# EAGLE design MUSB-K552_Breakout (EAGLE 9.6.2)
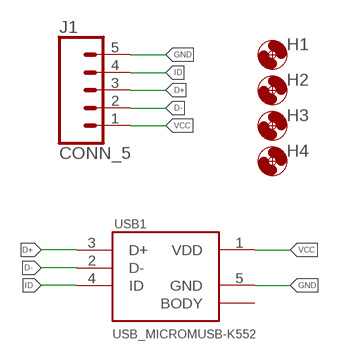
[diagram p0: schematic, sheet 1]

## Parts
H1  MOUNTING_HOLE2_NP  [2_56]
H2  MOUNTING_HOLE2_NP  [2_56]
H3  MOUNTING_HOLE2_NP  [2_56]
H4  MOUNTING_HOLE2_NP  [2_56]
J1  CONN_5  [1X05]
USB1  USB_MICROMUSB-K552  [MUSB-K552-30]

## Nets
D+: J1.3 USB1.3(D+)
D-: J1.2 USB1.2(D-)
GND: J1.5 USB1.5(GND)
ID: J1.4 USB1.4(ID)
VCC: J1.1 USB1.1(VDD)
Unconnected: USB1.P$1(BODY) USB1.P$2(BODY) USB1.P$3(BODY) USB1.P$4(BODY)

## Library data of the parts
H1-H4 = bschulz:MOUNTING_HOLE: Genaric Mechanical Mounting Hole Hole diameter based on max body diameter + 15% Keepout ring is for diameter of socket cap screw (minimum required clearance) TPlace ring is for diameter of pan head screw (recomended clearance) Specifications: Socket Cap <http://fastener-express.com/fastener-technical/SocketscapSS-Alloy.pdf> Button Head Socket Cap <http://fastener-express.com/fastener-technical/Button-Socket-alloy.pdf> Pan Head <http://fastener-express.com/fastener-technical/pan-machine-Screws.pdf>; DIGIKEY: DNP; MF: N/A; MPN: DNP
J1 = bschulz:CONN_5: Genaric 5 terminal header
USB1 = bschulz:USB_MICRO: General Micro USB - AB Connector; DIGIKEY: MUSB-K552-30-ND; MF: Amphenol; MPN: MUSB-K552-30

## Board
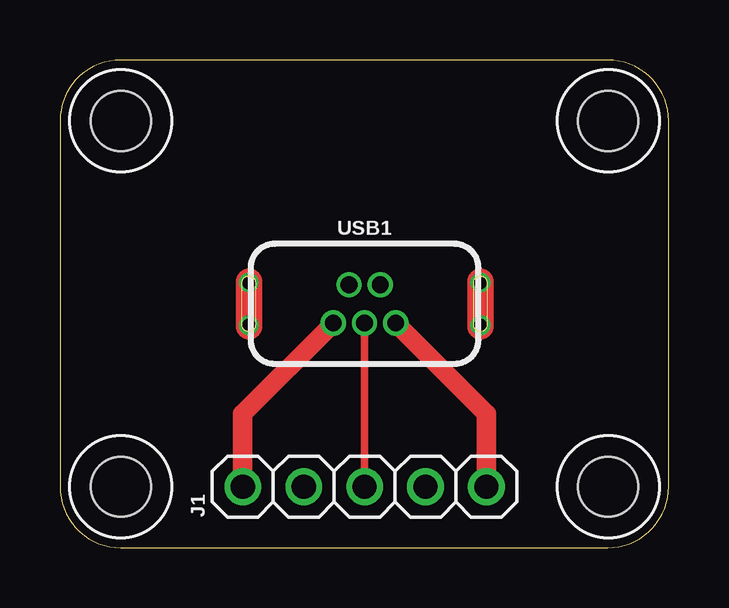
[diagram p1: board, top side]
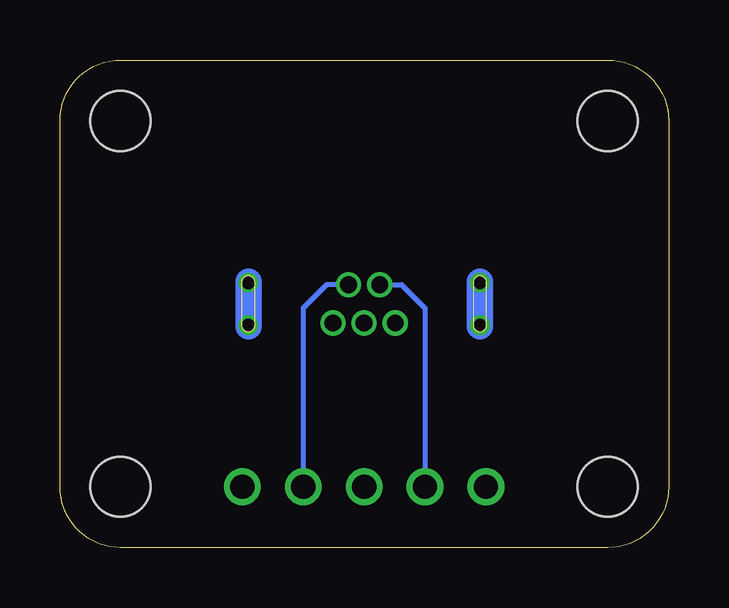
[diagram p2: board, bottom side, seen from below]

Size 25.38 x 20.32 mm. Coordinates in mm from the lower left corner, seen from the top.
Outline: 0,17.78 0,2.54 arc90 2.54,0 22.84,0 arc90 25.38,2.54 25.38,17.78 arc90 22.84,20.32 2.54,20.32 arc90 0,17.78
Copper layers (1*16): Top 0.035559375mm / dielectric 1.6mm / Bottom 0.035559375mm
Design rules "oshpark-2layer": minimum track width 6mil, minimum drill 10mil, track to track 6mil, track to pad 6mil, pad to pad 6mil, via to via 6mil, smd to smd 6mil, copper to edge 15mil, drill to drill 6mil, minimum pad ring 5mil, minimum via ring 5mil, stop-mask expansion 2.5mil, vias tented up to drill 0mil, thermal gap 10mil

### Footprints (pad centres in the part's own frame; a part is rotated, then mirrored left to right if it is on the bottom)
2_56 = hole 2.5: 0,0
1X05 = drill 1.016: 1 -5.08,0; 2 -2.54,0; 3 0,0; 4 2.54,0; 5 5.08,0
MUSB-K552-30 = drill 0.7: 1 -1.3,-0.8; 2 -0.65,0.8; 3 0,-0.8; 4 0.65,0.8; 5 1.3,-0.8 | drill 0.55: P$1 -4.826,0.889; P$2 -4.826,-0.889; P$3 4.826,-0.889; P$4 4.826,0.889

### Placement (x,y rotation side)
H1  2.54,2.54 0 top
H2  22.86,2.54 0 top
H3  2.54,17.78 0 top
H4  22.86,17.78 0 top
J1  12.7,2.54 0 top
USB1  12.7,10.16 0 top

### Tracks (layer width: path | path; a pad name or v marks a point on that pad's centre or on a via)
D+
  Top 0.305: USB1.3 J1.3
D-
  Bottom 0.2: USB1.2 11.14,10.96 10.16,9.98 J1.2
GND
  Top 0.813: USB1.5 17.78,5.58 J1.5
ID
  Bottom 0.2: USB1.4 14.26,10.96 15.24,9.98 J1.4
VCC
  Top 0.813: USB1.1 7.62,5.58 J1.1

### Text on the board
tDocu: USB Breakout / MUSB-K552 / v0.0 / Bobby Schulz | VCC | D- | D+ | ID | GND
bDocu: Break44